# EAGLE design Hexapod REV1 (EAGLE 7.7.0)
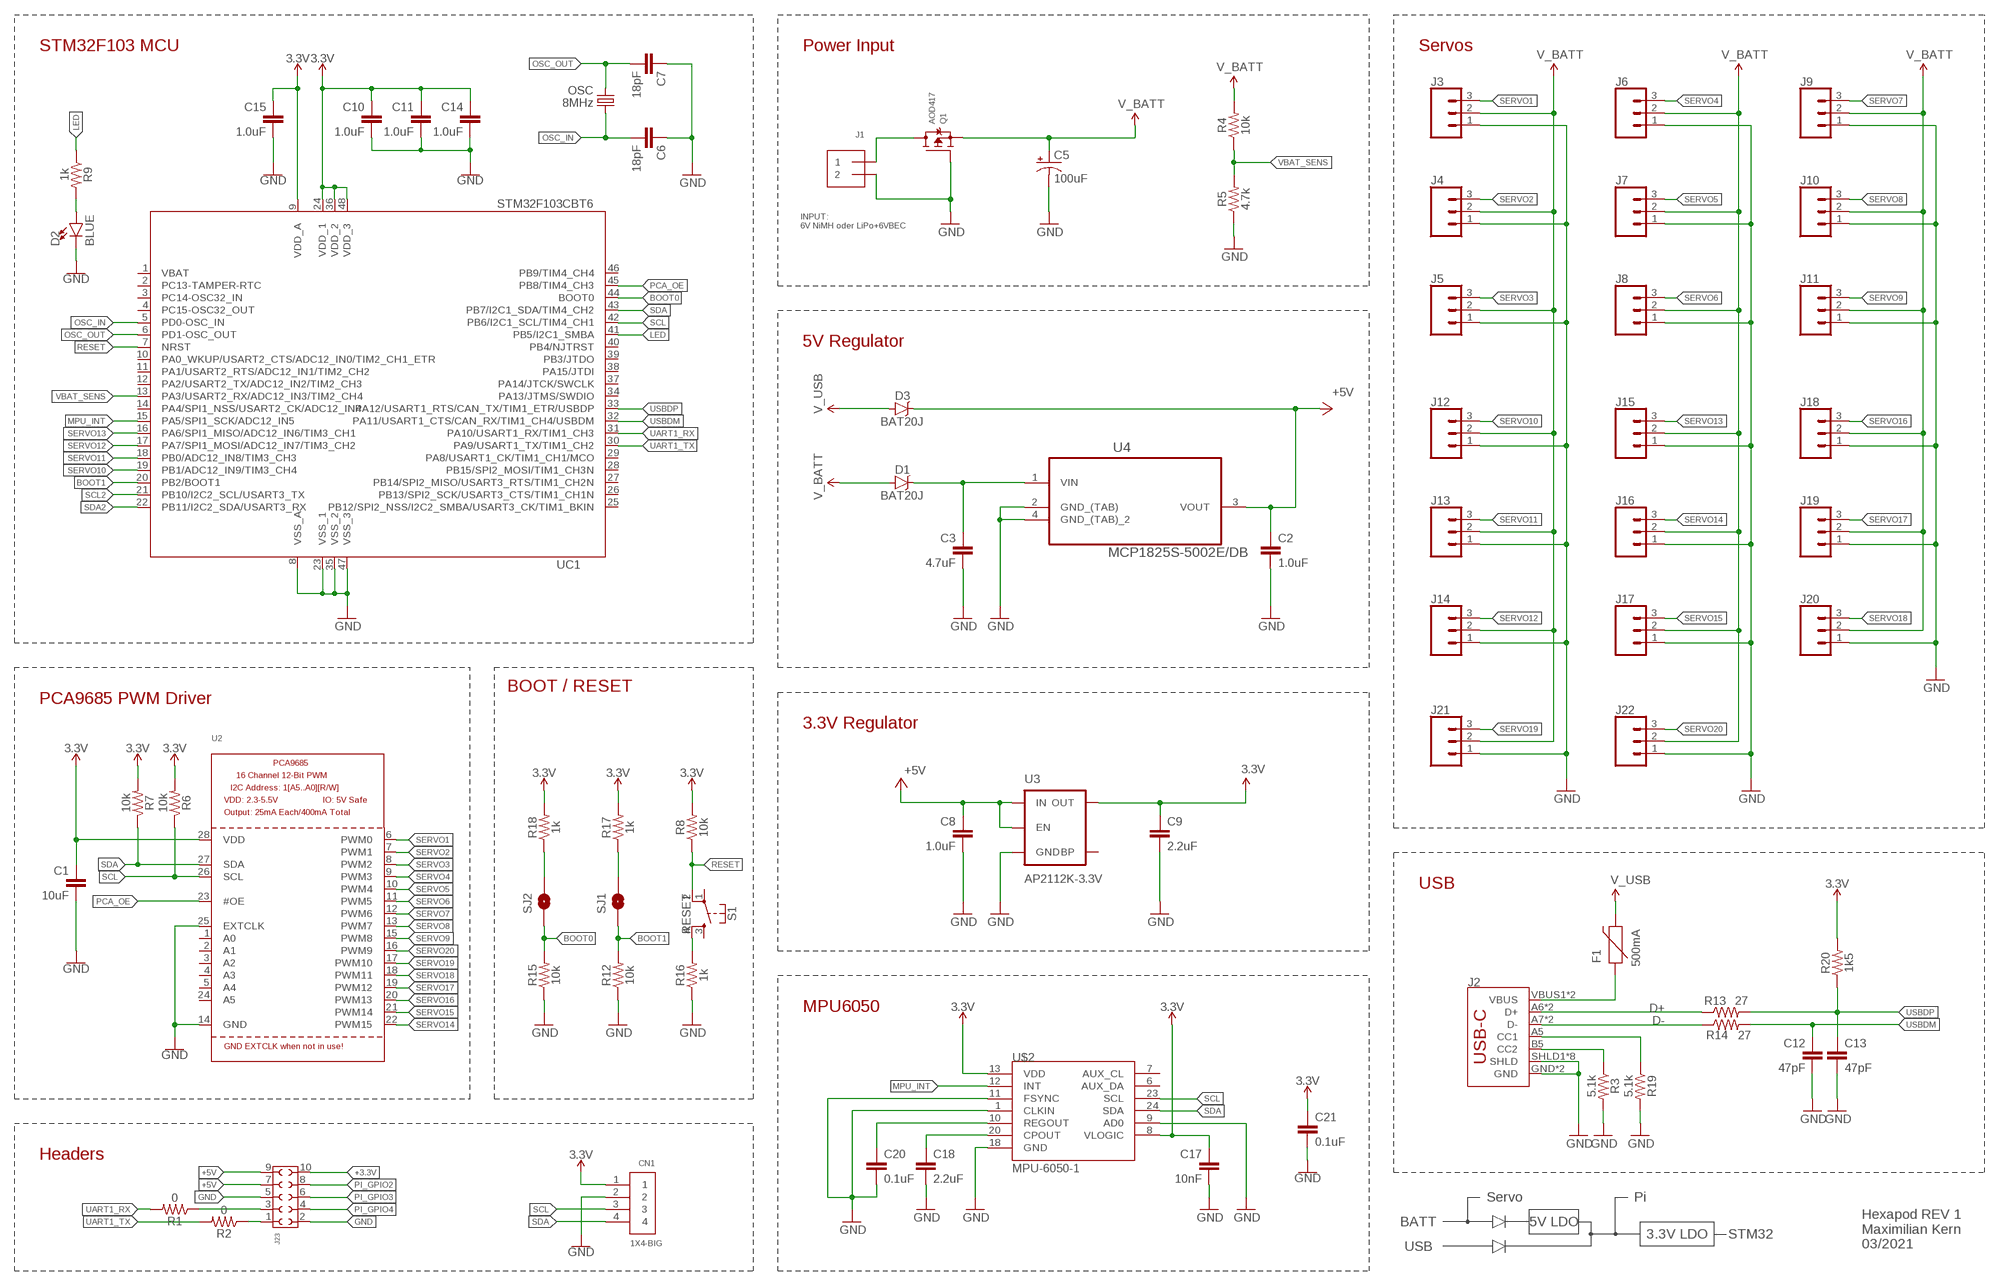
[diagram p0: schematic, sheet 1]

## Parts
C1  10uF  1.0UF-0805-25V-(+80/-20%)  [0805]
C2  1.0uF  1.0UF-0805-25V-(+80/-20%)  [0805]
C3  4.7uF  1.0UF-0805-25V-(+80/-20%)  [0805]
C5  100uF  100UF-POLAR-25V-20%(ELEC)  [PANASONIC_D]
C6  18pF  47PF-0603-50V-5%  [0603]
C7  18pF  47PF-0603-50V-5%  [0603]
C8  1.0uF  1.0UF-0805-25V-(+80/-20%)  [0805]
C9  2.2uF  1.0UF-0805-25V-(+80/-20%)  [0805]
C10  1.0uF  1.0UF-0805-25V-(+80/-20%)  [0805]
C11  1.0uF  1.0UF-0805-25V-(+80/-20%)  [0805]
C12  47pF  47PF-0603-50V-5%  [0603]
C13  47pF  47PF-0603-50V-5%  [0603]
C14  1.0uF  1.0UF-0805-25V-(+80/-20%)  [0805]
C15  1.0uF  1.0UF-0805-25V-(+80/-20%)  [0805]
C17  10nF  47PF-0603-50V-5%  [0603]
C18  2.2uF  1.0UF-0805-25V-(+80/-20%)  [0805]
C20  0.1uF  0.1UF-0603-25V-(+80/-20%)  [0603]
C21  0.1uF  0.1UF-0603-25V-(+80/-20%)  [0603]
CN1  1X4-BIG  [1X04-BIG]
D1  BAT20J  DIODE-SCHOTTKY-BAT20J  [SOD-323]
D2  BLUE  LED-BLUE0603  [LED-0603@2]
D3  BAT20J  DIODE-SCHOTTKY-BAT20J  [SOD-323]
F1  500mA  PTCSMD  [PTC-1206]
J1  TERMBLOCK_1X2  [TERMBLOCK_1X2-3.5MM]
J2  USB_C16PIN  [USB-C-16P]
J3  CONN_03  [1X03]
J4  CONN_03  [1X03]
J5  CONN_03  [1X03]
J6  CONN_03  [1X03]
J7  CONN_03  [1X03]
J8  CONN_03  [1X03]
J9  CONN_03  [1X03]
J10  CONN_03  [1X03]
J11  CONN_03  [1X03]
J12  CONN_03  [1X03]
J13  CONN_03  [1X03]
J14  CONN_03  [1X03]
J15  CONN_03  [1X03]
J16  CONN_03  [1X03]
J17  CONN_03  [1X03]
J18  CONN_03  [1X03]
J19  CONN_03  [1X03]
J20  CONN_03  [1X03]
J21  CONN_03  [1X03]
J22  CONN_03  [1X03]
J23  6103XX21821_61031021821  [61031021821]
OSC  8MHz  CRYSTAL5X3  [CRYSTAL-SMD-5X3]
Q1  AOD417  MOSFET-PTO252  [TO252]
R1  0  10KOHM-0603-1/10W-1%  [0603]
R2  0  10KOHM-0603-1/10W-1%  [0603]
R3  5.1k  10KOHM-0603-1/10W-1%  [0603]
R4  10k  10KOHM-0603-1/10W-1%  [0603]
R5  4.7k  10KOHM-0603-1/10W-1%  [0603]
R6  10k  10KOHM-0603-1/10W-1%  [0603]
R7  10k  10KOHM-0603-1/10W-1%  [0603]
R8  10k  10KOHM-0603-1/10W-1%  [0603]
R9  1k  1KOHM-0603-1/10W-1%  [0603]
R12  10k  10KOHM-0603-1/10W-1%  [0603]
R13  27  27OHM1/10W1%(0603)0603-RES  [0603]
R14  27  27OHM1/10W1%(0603)0603-RES  [0603]
R15  10k  10KOHM-0603-1/10W-1%  [0603]
R16  1k  10KOHM-0603-1/10W-1%  [0603]
R17  1k  10KOHM-0603-1/10W-1%  [0603]
R18  1k  10KOHM-0603-1/10W-1%  [0603]
R19  5.1k  10KOHM-0603-1/10W-1%  [0603]
R20  1k5  10KOHM-0603-1/10W-1%  [0603]
S1  RESET  MOMENTARY-SWITCH-SPST-2-SMD-4.6X2.8MM  [TACTILE_SWITCH_SMD_4.6X2.8MM]
SJ1  JUMPER-PAD-2-NOYES_SILK  [PAD-JUMPER-2-NO_YES_SILK]
SJ2  JUMPER-PAD-2-NOYES_SILK  [PAD-JUMPER-2-NO_YES_SILK]
U2  PCA9685  [TSSOP28]
U3  AP2112K-3.3V  V_REG_LDOSMD  [SOT23-5]
U4  MCP1825S-5002E/DB  [SOT230P700X180-4N]
U$2  MPU-6050-1  [QFN-24-4MM2]
UC1  STM32F103CBT6  STM32F103CB  [LQFP48]

## Nets
3.3V: C1.1 C9.1 C10.1 C11.1 C14.1 C15.1 C17.1 C21.1 CN1.1 R6.2 R7.2 R8.2 R17.2 R18.2 R20.2 U2.28(VDD) U3.5(OUT) U$2.8(VLOGIC) U$2.13(VDD) UC1.9(VDD_A) UC1.24(VDD_1) UC1.36(VDD_2) UC1.48(VDD_3)
+3.3V: J23.10
+5V: C2.1 C8.1 D3.C J23.7 J23.9 U3.1(IN) U3.3(EN) U4.3(VOUT)
BOOT0: R15.2 SJ2.1 UC1.44(BOOT0)
BOOT1: R12.2 SJ1.1 UC1.20(PB2/BOOT1)
D+: J2.A6(D+) J2.B6(D+) R13.1
D-: J2.A7(D-) J2.B7(D-) R14.1
GND: C1.2 C2.2 C3.2 C5.- C6.1 C7.1 C8.2 C9.2 C10.2 C11.2 C12.2 C13.2 C14.2 C15.2 C17.2 C18.2 C20.2 C21.2 CN1.2 D2.C J1.2 J2.GND J2.GND2(GND) J2.SHLD1(SHLD) J2.SHLD2(SHLD) J2.SHLD3(SHLD) J2.SHLD4(SHLD) J2.SHLD5(SHLD) J2.SHLD6(SHLD) J2.SHLD7(SHLD) J2.SHLD8(SHLD) J3.1 J4.1 J5.1 J6.1 J7.1 J8.1 J9.1 J10.1 J11.1 J12.1 J13.1 J14.1 J15.1 J16.1 J17.1 J18.1 J19.1 J20.1 J21.1 J22.1 J23.2 J23.5 Q1.1(G) R3.2 R5.1 R12.1 R15.1 R16.1 R19.2 U2.14(GND) U2.25(EXTCLK) U3.2(GND) U4.2(GND_(TAB)) U4.4(GND_(TAB)_2) U$2.1(CLKIN) U$2.9(AD0) U$2.11(FSYNC) U$2.18(GND) UC1.8(VSS_A) UC1.23(VSS_1) UC1.35(VSS_2) UC1.47(VSS_3)
LED: R9.1 UC1.41(PB5/I2C1_SMBA)
MPU_INT: U$2.12(INT) UC1.15(PA5/SPI1_SCK/ADC12_IN5)
N$1: R16.2 S1.4
N$2: R18.1 SJ2.2
N$3: R17.1 SJ1.2
N$4: C3.1 D1.C U4.1(VIN)
N$5: D2.A R9.2
N$6: J1.1 Q1.3(D)
N$9: J2.A5(CC1) R19.1
N$11: J2.B5(CC2) R3.1
N$17: C18.1 U$2.20(CPOUT)
N$18: C20.1 U$2.10(REGOUT)
OSC_IN: C6.2 OSC.1 UC1.5(PD0-OSC_IN)
OSC_OUT: C7.2 OSC.3 UC1.6(PD1-OSC_OUT)
PCA_OE: U2.23(#OE) UC1.45(PB8/TIM4_CH3)
PI_GPIO2: J23.8
PI_GPIO3: J23.6
PI_GPIO4: J23.4
PI_RXD: J23.1 R2.1
PI_TXD: J23.3 R1.1
RESET: R8.1 S1.2 UC1.7(NRST)
SCL: CN1.3 R6.1 U2.26(SCL) U$2.23(SCL) UC1.42(PB6/I2C1_SCL/TIM4_CH1)
SCL2: UC1.21(PB10/I2C2_SCL/USART3_TX)
SDA: CN1.4 R7.1 U2.27(SDA) U$2.24(SDA) UC1.43(PB7/I2C1_SDA/TIM4_CH2)
SDA2: UC1.22(PB11/I2C2_SDA/USART3_RX)
SERVO1: J3.3 U2.6(PWM0)
SERVO2: J4.3 U2.7(PWM1)
SERVO3: J5.3 U2.8(PWM2)
SERVO4: J6.3 U2.9(PWM3)
SERVO5: J7.3 U2.10(PWM4)
SERVO6: J8.3 U2.11(PWM5)
SERVO7: J9.3 U2.12(PWM6)
SERVO8: J10.3 U2.13(PWM7)
SERVO9: J11.3 U2.15(PWM8)
SERVO10: J12.3 UC1.19(PB1/ADC12_IN9/TIM3_CH4)
SERVO11: J13.3 UC1.18(PB0/ADC12_IN8/TIM3_CH3)
SERVO12: J14.3 UC1.17(PA7/SPI1_MOSI/ADC12_IN7/TIM3_CH2)
SERVO13: J15.3 UC1.16(PA6/SPI1_MISO/ADC12_IN6/TIM3_CH1)
SERVO14: J16.3 U2.22(PWM15)
SERVO15: J17.3 U2.21(PWM14)
SERVO16: J18.3 U2.20(PWM13)
SERVO17: J19.3 U2.19(PWM12)
SERVO18: J20.3 U2.18(PWM11)
SERVO19: J21.3 U2.17(PWM10)
SERVO20: J22.3 U2.16(PWM9)
UART1_RX: R1.2 UC1.31(PA10/USART1_RX/TIM1_CH3)
UART1_TX: R2.2 UC1.30(PA9/USART1_TX/TIM1_CH2)
USBDM: C12.1 R14.2 UC1.32(PA11/USART1_CTS/CAN_RX/TIM1_CH4/USBDM)
USBDP: C13.1 R13.2 R20.1 UC1.33(PA12/USART1_RTS/CAN_TX/TIM1_ETR/USBDP)
V_BATT: C5.+ D1.A J3.2 J4.2 J5.2 J6.2 J7.2 J8.2 J9.2 J10.2 J11.2 J12.2 J13.2 J14.2 J15.2 J16.2 J17.2 J18.2 J19.2 J20.2 J21.2 J22.2 Q1.2(S) R4.2
V_USB: D3.A F1.2
VBAT_SENS: R4.1 R5.2 UC1.13(PA3/USART2_RX/ADC12_IN3/TIM2_CH4)
VUSB-RAW: F1.1 J2.VBUS1(VBUS) J2.VBUS2(VBUS)
Unconnected: S1.1 S1.3 U2.1(A0) U2.2(A1) U2.3(A2) U2.4(A3) U2.5(A4) U2.24(A5) U3.4(BP) U$2.6(AUX_DA) U$2.7(AUX_CL) UC1.2(PC13-TAMPER-RTC) UC1.3(PC14-OSC32_IN) UC1.4(PC15-OSC32_OUT) UC1.10(PA0_WKUP/USART2_CTS/ADC12_IN0/TIM2_CH1_ETR) UC1.11(PA1/USART2_RTS/ADC12_IN1/TIM2_CH2) UC1.12(PA2/USART2_TX/ADC12_IN2/TIM2_CH3) UC1.14(PA4/SPI1_NSS/USART2_CK/ADC12_IN4) UC1.25(PB12/SPI2_NSS/I2C2_SMBA/USART3_CK/TIM1_BKIN) UC1.26(PB13/SPI2_SCK/USART3_CTS/TIM1_CH1N) UC1.27(PB14/SPI2_MISO/USART3_RTS/TIM1_CH2N) UC1.28(PB15/SPI2_MOSI/TIM1_CH3N) UC1.29(PA8/USART1_CK/TIM1_CH1/MCO) UC1.34(PA13/JTMS/SWDIO) UC1.37(PA14/JTCK/SWCLK) UC1.38(PA15/JTDI) UC1.39(PB3/JTDO) UC1.40(PB4/NJTRST) UC1.46(PB9/TIM4_CH4)

## Notes on the sheet
- STM32F103 MCU | Power Input | Servos
- INPUT:
  6V NiMH oder LiPo+6VBEC
- 5V Regulator
- BOOT / RESET
- PCA9685 PWM Driver
- 3.3V Regulator
- USB
- MPU6050
- Headers
- Servo | Pi
- Hexapod REV 1
  Maximilian Kern
  03/2021
- BATT | 5V LDO
- 3.3V LDO | STM32
- USB

## Power pins joined to a net without a drawn wire
VBAT: UC1.1(VBAT)

## Library data of the parts
C1 C3 C9 C18 = SparkFun-Capacitors:1.0UF: 1µF ceramic capacitors A capacitor is a passive two-terminal electrical component used to store electrical energy temporarily in an electric field.; PROD_ID: CAP-11625; VALUE: 1.0uF
C2 C8 C10 C11 C14 C15 = SparkFun-Capacitors:1.0UF: 1µF ceramic capacitors A capacitor is a passive two-terminal electrical component used to store electrical energy temporarily in an electric field.; PROD_ID: CAP-11625
C5 = SparkFun-Capacitors:100UF-POLAR: 100µF polarized capacitors A capacitor is a passive two-terminal electrical component used to store electrical energy temporarily in an electric field.; PROD_ID: CAP-12547
C6 C7 C17 = SparkFun-Capacitors:47PF: 47pF ceramic capacitors A capacitor is a passive two-terminal electrical component used to store electrical energy temporarily in an electric field.; PROD_ID: CAP-08913; VALUE: 47pF
C12 C13 = SparkFun-Capacitors:47PF: 47pF ceramic capacitors A capacitor is a passive two-terminal electrical component used to store electrical energy temporarily in an electric field.; PROD_ID: CAP-08913
C20 C21 = SparkFun-Capacitors:0.1UF: 0.1µF ceramic capacitors A capacitor is a passive two-terminal electrical component used to store electrical energy temporarily in an electric field.; PROD_ID: CAP-00810
CN1 = adafruit:1X4: 4-pin connector
D1 D3 = SparkFun-DiscreteSemi:DIODE-SCHOTTKY: Schottky diodes in SFE's production catalog BAT20J 1A 23V 0.62Vf RB751 120mA 40V 0.37Vf PMEG4005EJ 0.5A 40V 0.42Vf MBRA140 1A 40V 0.5Vf B340A 3A 40V SMA; PROD_ID: DIO-11623
D2 = SparkFun-LED:LED-BLUE: Blue SMD LED Used in manufacturing of various products at SparkFun Packages: 0603 - SMD 0603 package [Product Link] <http://www.digikey.com/product-detail/en/SMLE12BC7TT86/511-1589-2-ND/1641808> 1206 - SMD1206 package [Product Link] <http://www.digikey.com/product-detail/en/lite-on-inc/LTST-C150TBKT/160-1643-1-ND/573584> SparkFun Products: ESP8266 Thing-Dev Board <https://www.sparkfun.com/products/13711> RedBoard <https://www.sparkfun.com/products/12757>; PROD_ID: DIO-08575
F1 = SparkFun-PowerIC:PTC: Resettable Fuse PTC Resettable Fuse. Spark Fun Electronics SKU : COM-08357; PROD_ID: RES-11150
J1 = microbuilder:TERMBLOCK_1X2: 3.5mm Terminal block http://www.ladyada.net/library/pcb/eaglelibrary.html
J2 = SparkFun-Connectors:USB_C: USB Type C 16Pin Connector Super Speed pins not available on the 16-pin purely SMD connector so this part is best for USB 2.0 implementations. D1 and D2 are tied together enabling D+/- no matter which way the cable is plugged into the connector. The two channel configuration pins (CC1/2) are exposed. These are normally connected to ground via 5.1k resistors but can be reconfigured for high current/high power applications.; PROD_ID: CONN-14122
J3-J22 = SparkFun-Connectors:CONN_03: Multi connection point. Often used as Generic Header-pin footprint for 0.1 inch spaced/style header connections On any of the 0.1 inch spaced packages, you can populate with these: Break Away Headers - Straight <https://www.sparkfun.com/products/116> (PRT-00116) Break Away Male Headers - Right Angle <https://www.sparkfun.com/products/553> (PRT-00553) Female Headers <https://www.sparkfun.com/products/115> (PRT-00115) Break Away Headers - Machine Pin <https://www.sparkfun.com/products/117> (PRT-00117) Break Away Female Headers - Swiss Machine Pin <https://www.sparkfun.com/products/743> (PRT-00743) Stackable Header - 3 Pin (Female, 0.1") <https://www.sparkfun.com/products/13875> (PRT-13875) For SCREWTERMINALS and SPRING TERMINALS visit here: Screw Terimnals on SparkFun.com <https://www.sparkfun.com/search/results?term=Screw+Terminals> (5mm/3.5mm/2.54mm spacing) This device is also useful as a general connection point to wire up your design to another part of your project. Our various solder wires solder well into these plated through hole pads. Hook-Up Wire - Assortment (Stranded, 22 AWG) <https://www.sparkfun.com/products/11375> (PRT-11375) Hook-Up Wire - Assortment (Solid Core, 22 AWG) <https://www.sparkfun.com/products/11367> (PRT-11367) View the entire wire category on our website here <https://www.sparkfun.com/categories/141> Special notes: Molex polarized connector foot print use with SKU : PRT-08232 with associated crimp pins and housings.; PROD_ID: XXX-00000; VALUE: 455-1750-1-ND
J23 = Eagle_WR-PHD (rev19a):6103XX21821_61031021821: WR-PHD 2.54 mm SMT Dual Socket Header (Reel) ARTICLE PROPERTIES Pins ： 4;​ 6;​ 8;​ 10;​ 12;​ 14;​ 16;​ 18;​ 20;​ 22;​ 24;​ 26 KIND PROPERTIES Pitch 2.54 mm Quality Class 3 as per CECC 75 301-802 Rows Dual Gender Socket Header Type Straight Type 2 MATERIAL PROPERTIES Insulator Material PA46 Insulator Flammability Rating UL94 V-0 Contact Material Copper Alloy Contact Plating Gold Contact Type Stamped GENERAL INFORMATION Operating Temperature -40 up to +105 °C ELECTRICAL PROPERTIES Rated Current 3 A IR1 = 3A Withstanding Voltage 600 V (AC) Contact Resistance 20 mΩ RISO 1000 MΩ CERTIFICATION UL Approval E323964 PACKAGING PROPERTIES Packaging Tape and Reel with Cap <https://katalog.we-online.com/media/images/v2/o33206v209%20Family_WR-PHD_610xxx21821.jpg> Details see: https://katalog.we-online.com/en/em/PHD_2_54_SMT_DUAL_SOCKET_HEADER_REEL_6103XX21821 Updated by Ella Wu 2019-06-12 2019 (C) Würth Elektronik; DATASHEET-URL: https://katalog.we-online.com/em/datasheet/61031021821.pdf; GENDER: Socket Header; IR: 3A; PACKAGING: Tape and Reel with Cap; PART-NUMBER: 61031021821; PINS: 10; ROWS: Dual; TYPE: Straight Type 2; WE-NUMBER: 61031021821
OSC = SparkFun2:CRYSTAL: Crystals Various standard crystals. Proven footprints. Spark Fun Electronics SKU : COM-00534
Q1 = microbuilder:MOSFET-P: P-Channel Mosfet LEGEND VDS: Voltage Drain-Source ID: Drain Current RDS(ON): Drain-Source On-State Resistance VGS(TH): Gate-Source Threshold Voltage CISS: Drain-Source Input Capacitance SOT-23 Name VDS ID RDS(ON) VGS(TH) CISS Order Number IRLML5103 30V 760mA 600 mOhm -- 75pF @ 25V Digikey: IRLML5103PBFCT-ND IRLML6401 12V 4.3A 50 mOhm 950mV @ 250µA 830pF @ 10V Digikey: IRLML6401PBFTR-ND NTR0202PL 20V 400mA 800 mOhm 2.3V @ 250uA 70pF @ 5V Digikey: NTR0202PLT1GOSTR-ND NTR4101PT1G 20V 1.8A 85 mOhm 1.2V @ 250uA 675pF @ 10V Digikey: NTR4101PT1GOSCT-ND DMP2004K 20V 600mA 900 mOhm 1V @ 250uA 175pF @ 16V Digikey: DMP2004KDICT-ND PMV65XP 20V 3.9A 76 mOhm 950mV @ 1mA 725pF @ 20V Digikey: 568-2358-2-ND TO-252 Name VDS ID RDS(ON) VGS(TH) CISS Order Number AOD417 30V 25A 34 mOhm 3V @ 250µA 920pF @ 15V Digikey: 785-1106-2-ND
R1-R3 R5 R16-R20 = SparkFun-Resistors:10KOHM: 10kΩ resistor A resistor is a passive two-terminal electrical component that implements electrical resistance as a circuit element. Resistors act to reduce current flow, and, at the same time, act to lower voltage levels within circuits. - Wikipedia; PROD_ID: RES-00824; VALUE: 10k
R4 R6-R8 R12 R15 = SparkFun-Resistors:10KOHM: 10kΩ resistor A resistor is a passive two-terminal electrical component that implements electrical resistance as a circuit element. Resistors act to reduce current flow, and, at the same time, act to lower voltage levels within circuits. - Wikipedia; PROD_ID: RES-00824
R9 = SparkFun-Resistors:1KOHM: 1kΩ resistor A resistor is a passive two-terminal electrical component that implements electrical resistance as a circuit element. Resistors act to reduce current flow, and, at the same time, act to lower voltage levels within circuits. - Wikipedia; PROD_ID: RES-07856
R13 R14 = SparkFun-Resistors:27OHM1/10W1%(0603): RES-09334; PROD_ID: RES-09334
S1 = SparkFun-Switches:MOMENTARY-SWITCH-SPST-2: Momentary Switch (Pushbutton) - SPST - Two Circuits Normally-open (NO) SPST momentary switches (buttons, pushbuttons). Schematic symbol includes two switch circuits. Variants SMD-4.6MMX2.8MM - 4.60mm x 2.80mm Tactile Momentary Button Switch - Used on SparkFun SAMD21 Mini Breakout <https://www.sparkfun.com/products/13664> SMD-5.2MM - Mini Pushbutton Switch - SMD <https://www.sparkfun.com/products/8720> - Used on Arduino Pro Mini <https://www.sparkfun.com/products/11114>; PROD_ID: SWCH-13065
SJ1 SJ2 = SparkFun-Passives:JUMPER-PAD-2-NO
U2 = adafruit:PCA9685: PCA9685 - 16 Channel 12-Bit I2C PWM Controller 5.0V tolerant 16 channel, 12-bit I2C PWM controller with 25mA per output (max. 400mA total) Digikey: 568-5931-1-ND
U3 = SparkFun-PowerIC:V_REG_LDO: Voltage Regulator LDO Standard 150mA LDO voltage regulator in SOT-23 layout. Micrel part MIC5205. BP (by-pass) pin is used to lower output noise with 470pF cap.; PROD_ID: VREG-12457
U4 = Microchip_By_element14_Batch_1:MCP1825S-5002E/DB: IC, LDO, 5.0V, 500MA; MPN: MCP1825S-5002E/DB; OC_FARNELL: 1578407; OC_NEWARK: 26M9964; PACKAGE: SOT-223-3; SUPPLIER: Microchip
U$2 = MPU-6050 hand solder:MPU-6050
UC1 = stm32:STM32F103CB

## Board
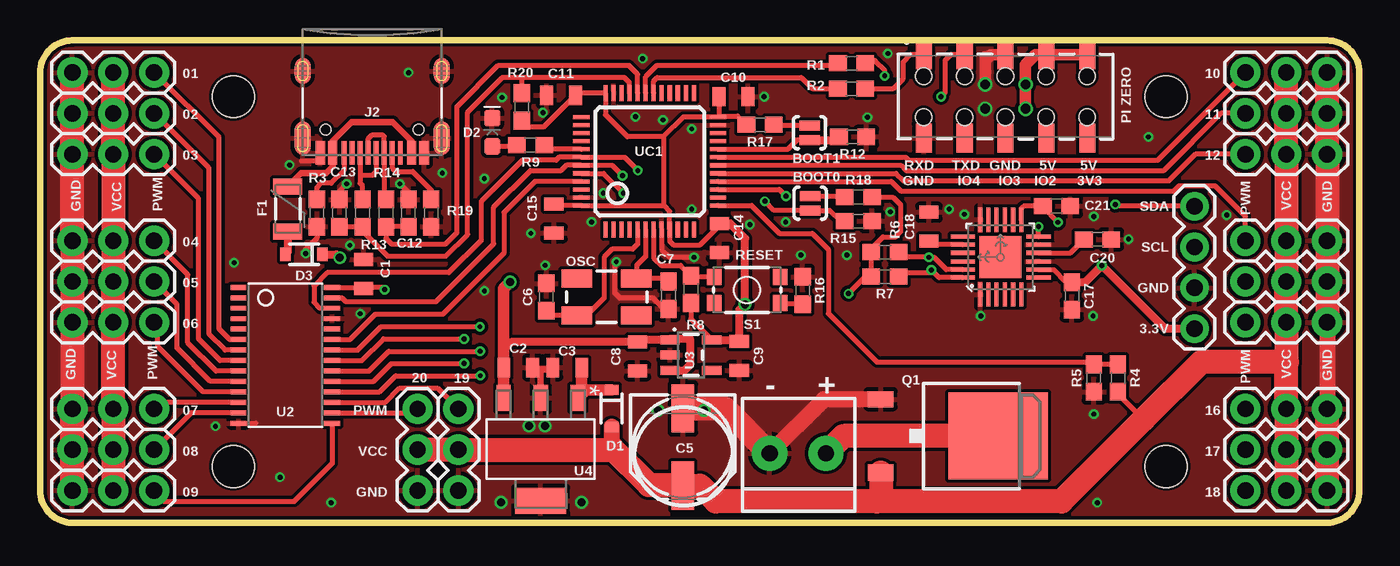
[diagram p1: board, top side]
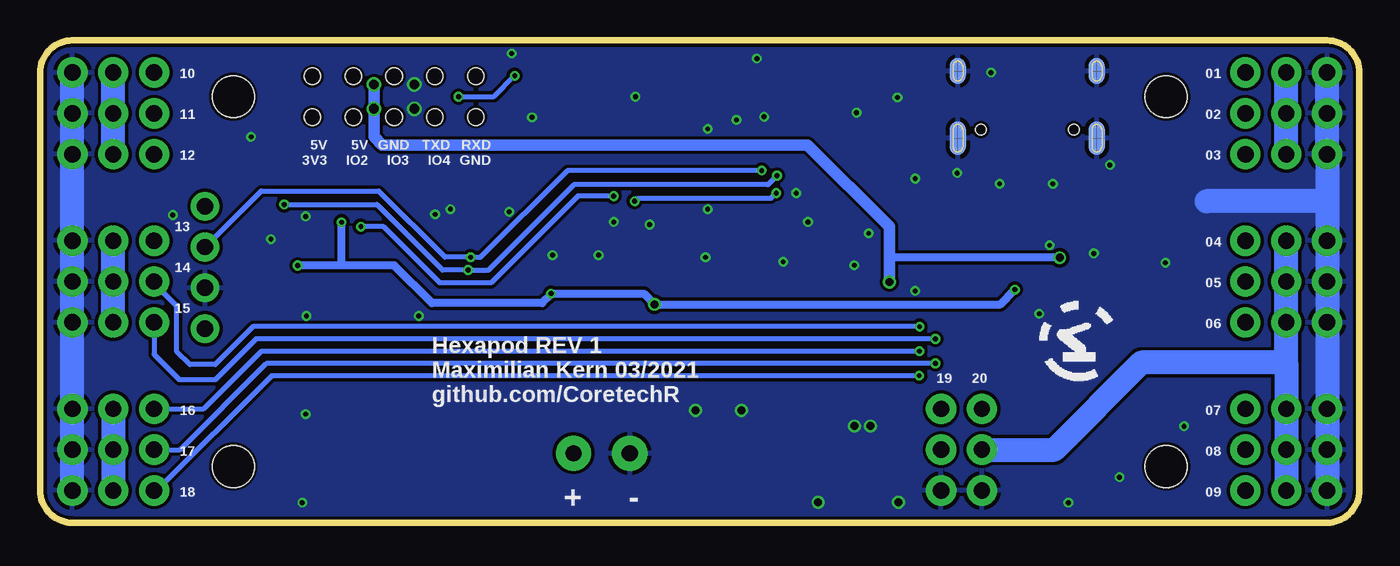
[diagram p2: board, bottom side, seen from below]

Size 82 x 30 mm. Coordinates in mm from the lower left corner, seen from the top.
Outline: 2,0 arc-90 0,2 0,28 arc-90 2,30 80,30 arc-90 82,28 82,2 arc-90 80,0 2,0
Copper layers (1*16): Top 0.035mm / dielectric 1.5mm / Bottom 0.035mm
Design rules "aisler_2_layer *": minimum track width 0.2mm, minimum drill 0.2mm, track to track 0.2mm, track to pad 0.2mm, pad to pad 0.2mm, via to via 0.2mm, smd to smd 0.1mm, copper to edge 0.2mm, drill to drill 0.21mm, minimum pad ring 0.25mm, minimum via ring 0.15mm, stop-mask expansion 2.5mil, vias tented up to drill 43mil, thermal gap 10mil
Holes 2.6 mm at 70,26.5 12,26.5 12,3.5 70,3.5
Holes 1 mm at 54.92,27.77 57.46,27.77 60,27.77 62.54,27.77 65.08,27.77 65.08,25.23 62.54,25.23 60,25.23 57.46,25.23 54.92,25.23

### Footprints (pad centres in the part's own frame; a part is rotated, then mirrored left to right if it is on the bottom)
0805 = smd 0.8 x 1.2: 1 -0.9,0; 2 0.9,0
PANASONIC_D = smd 3 x 1.4: + 2.4,0; - -2.4,0
0603 = smd 1.1 x 1: 1 -0.85,0; 2 0.85,0
1X04-BIG = drill 1.016 pad 1.778: 1 0,0; 2 2.54,0; 3 5.08,0; 4 7.62,0
SOD-323 = smd 0.63 x 0.83: A 1.15,0; C -1.15,0
LED-0603@2 = smd 1 x 1: A -0.877,0; C 0.877,0
PTC-1206 = smd 1 x 1.8: 1 -1.4,0; 2 1.4,0
TERMBLOCK_1X2-3.5MM = drill 1 pad 2.184: 1 1.8,0; 2 -1.7,0
USB-C-16P = smd 0.3 x 1.45: A5 -1.25,0; A6 -0.25,0; A7 0.25,0; A8 1.25,0; B5 1.75,0; B6 0.75,0; B7 -0.75,0; B8 -1.75,0 | smd 0.6 x 1.45: GND -3.225,0; GND2 3.225,0 | smd 1 x 2.1: SHLD1 -4.32,-0.915; SHLD2 4.32,-0.915 | smd 1 x 2.1 bottom: SHLD3 -4.32,-0.915; SHLD4 4.32,-0.915 | smd 1 x 1.6: SHLD5 -4.32,-5.095; SHLD8 4.32,-5.095 | smd 1 x 1.6 bottom: SHLD6 -4.32,-5.095; SHLD7 4.32,-5.095 | smd 0.55 x 1.45: VBUS1 -2.45,0; VBUS2 2.45,0 | hole 0.65: -2.89,-1.445; 2.89,-1.445
1X03 = drill 1.016 pad 1.88: 1 0,0; 2 2.54,0; 3 5.08,0
61031021821 = smd 1 x 1.8: 1 -5.08,2.6; 2 -5.08,-2.6; 3 -2.54,2.6; 4 -2.54,-2.6; 5 0,2.6; 6 0,-2.6; 7 2.54,2.6; 8 2.54,-2.6; 9 5.08,2.6; 10 5.08,-2.6
CRYSTAL-SMD-5X3 = smd 1.9 x 1.1: 1 -1.85,-1.15; 2 1.85,-1.15; 3 1.85,1.15; 4 -1.85,1.15
TO252 = smd 1 x 1.6: 1 -2.28,-4.8; 2 2.28,-4.8 | smd 5.4 x 6.2: 3 0,2.5
TACTILE_SWITCH_SMD_4.6X2.8MM = smd 0.9 x 1: 1 -2.05,-0.8; 2 2.05,-0.8; 3 2.05,0.8; 4 -2.05,0.8
PAD-JUMPER-2-NO_YES_SILK = smd 0.635 x 1.27: 1 -0.45,0; 2 0.45,0
TSSOP28 = smd 0.305 x 0.991: 1 -4.225,-2.918; 2 -3.575,-2.918; 3 -2.925,-2.918; 4 -2.275,-2.918; 5 -1.625,-2.918; 6 -0.975,-2.918; 7 -0.325,-2.918; 8 0.325,-2.918; 9 0.975,-2.918; 10 1.625,-2.918; 11 2.275,-2.918; 12 2.925,-2.918; 13 3.575,-2.918; 14 4.225,-2.918; 15 4.225,2.918; 16 3.575,2.918; 17 2.925,2.918; 18 2.275,2.918; 19 1.625,2.918; 20 0.975,2.918; 21 0.325,2.918; 22 -0.325,2.918; 23 -0.975,2.918; 24 -1.625,2.918; 25 -2.275,2.918; 26 -2.925,2.918; 27 -3.575,2.918; 28 -4.225,2.918
SOT23-5 = smd 0.55 x 1.2: 1 -0.95,-1.3; 2 0,-1.3; 3 0.95,-1.3; 4 0.95,1.3; 5 -0.95,1.3
SOT230P700X180-4N = smd 1.626 x 0.889: 1 -3.2,2.311; 2 -3.2,0; 3 -3.2,-2.311 | smd 1.626 x 3.175: 4 3.2,0
QFN-24-4MM2 = smd 1.516 x 0.254: 1 -2.316,1.257; 2 -2.316,0.75; 3 -2.316,0.247; 4 -2.316,-0.287; 5 -2.316,-0.792; 6 -2.316,-1.297; 13 2.336,-1.297; 14 2.336,-0.792; 15 2.336,-0.287; 16 2.336,0.247; 17 2.336,0.75; 18 2.336,1.257 | smd 0.254 x 1.516: 7 -1.267,-2.372; 8 -0.762,-2.372; 9 -0.258,-2.372; 10 0.278,-2.372; 11 0.78,-2.372; 12 1.287,-2.372; 19 1.287,2.332; 20 0.78,2.332; 21 0.278,2.332; 22 -0.258,2.332; 23 -0.762,2.332; 24 -1.267,2.332 | smd 2.616 x 2.616: P$1 0.02,-0.01
LQFP48 = smd 0.254 x 1: 1 -2.75,-4.25; 2 -2.25,-4.25; 3 -1.75,-4.25; 4 -1.25,-4.25; 5 -0.75,-4.25; 6 -0.25,-4.25; 7 0.25,-4.25; 8 0.75,-4.25; 9 1.25,-4.25; 10 1.75,-4.25; 11 2.25,-4.25; 12 2.75,-4.25; 25 2.75,4.25; 26 2.25,4.25; 27 1.75,4.25; 28 1.25,4.25; 29 0.75,4.25; 30 0.25,4.25; 31 -0.25,4.25; 32 -0.75,4.25; 33 -1.25,4.25; 34 -1.75,4.25; 35 -2.25,4.25; 36 -2.75,4.25 | smd 1 x 0.254: 13 4.25,-2.75; 14 4.25,-2.25; 15 4.25,-1.75; 16 4.25,-1.25; 17 4.25,-0.75; 18 4.25,-0.25; 19 4.25,0.25; 20 4.25,0.75; 21 4.25,1.25; 22 4.25,1.75; 23 4.25,2.25; 24 4.25,2.75; 37 -4.25,2.75; 38 -4.25,2.25; 39 -4.25,1.75; 40 -4.25,1.25; 41 -4.25,0.75; 42 -4.25,0.25; 43 -4.25,-0.25; 44 -4.25,-0.75; 45 -4.25,-1.25; 46 -4.25,-1.75; 47 -4.25,-2.25; 48 -4.25,-2.75

### Placement (x,y rotation side)
C1  20.11,15.47 90 top
C2  29.72,9.65 0 top
C3  32.77,9.65 180 top
C5  39.95,4.71 270 top
C6  31.46,14.04 270 top
C7  39.06,14.15 90 top
C8  37.14,10.34 270 top
C9  43.46,10.37 270 top
C10  43.1,26.5 0 top
C11  32.37,26.59 180 top
C12  22.9,19.26 90 top
C13  18.6,19.26 90 top
C14  42.23,17.71 270 top
C15  31.93,18.92 270 top
C17  64.14,14.11 270 top
C18  55.24,18.41 90 top
C20  65.72,17.62 0 top
C21  63.18,19.68 0 top
CN1  71.75,12.06 90 top
D1  35.53,7.11 270 top
D2  28.1,24.29 90 top
D3  16.39,16.69 180 top
F1  15.39,19.52 270 top
J1  47.05,4.32 0 top
J2  20.64,23 180 top
J3  2,28 0 top
J4  2,25.46 0 top
J5  2,22.92 0 top
J6  2,17.54 0 top
J7  2,15 0 top
J8  2,12.46 0 top
J9  2,7.08 0 top
J10  2,4.54 0 top
J11  2,2 0 top
J12  80,28 180 top
J13  80,25.46 180 top
J14  80,22.92 180 top
J15  80,17.54 180 top
J16  80,15 180 top
J17  80,12.46 180 top
J18  80,7.08 180 top
J19  80,4.54 180 top
J20  80,2 180 top
J21  26,2 90 top
J22  23.46,2 90 top
J23  60.01,26.51 0 top
OSC  35.21,14.04 0 top
Q1  57.05,5.4 270 top
R1  50.44,28.57 180 top
R2  50.44,26.99 180 top
R3  17.2,19.26 270 top
R4  67,9 270 top
R5  65.5,9 90 top
R6  52.51,16.83 180 top
R7  52.51,15.3 180 top
R8  40.45,14.51 270 top
R9  30.48,23.5 180 top
R12  50.5,24 180 top
R13  20.04,19.26 270 top
R14  21.5,19.26 270 top
R15  50.87,18.75 180 top
R16  47.4,14.44 270 top
R17  44.75,24.75 180 top
R18  50.87,20.25 0 top
R19  24.3,19.26 270 top
R20  29.94,25.86 270 top
S1  43.94,14.48 180 top
SJ1  47.82,24.25 90 top
SJ2  47.86,19.87 90 top
U2  15.24,10.41 270 top
U3  40.45,10.43 270 top
U4  31.11,4.57 270 top
U$2  59.69,16.51 90 top
UC1  37.88,22.48 0 top

### Tracks (layer width: path | path; a pad name or v marks a point on that pad's centre or on a via)
3.3V  (via drill 0.3, 0.5)
  Top 0.3: R8.2 40.45,12.68 U3.5 | U$2.8 63,15.75 63.79,14.96 C17.1 | C15.1 32.03,19.73 UC1.48 38.77,19.73 | U$2.13 60.99,19.55 61.12,19.68 C21.1 62.33,19.62 v63.27,18.68 | v21.41,14.5 21.27,14.64 20.18,14.64 C1.1 20.04,14.64 U2.28 | C10.1 42.2,25.29 | 42.2,25.29 UC1.24 39.98,25.23 38.75,24 | R18.2 53,20.25 53.5,19.75 53.5,18.1 53.18,17.78 52.39,17.78 51.66,17.06 R6.2 R7.2 51.3,15.3 v50.25,14.25 | 38.77,19.73 39.13,19.37 UC1.9 39.13,17.51 39.37,17.27 41.02,17.27 42.23,18.47 C14.1 | 38.75,24 38.75,19.75 38.77,19.73 | 38.75,24 36.5,24 35.13,25.37 UC1.36 33.41,26.73 C11.1 31.29,24.61 30.35,24.61 R20.2 | 42.2,25.29 43.36,25.29 R17.2
  Top 0.5: U3.5 43.36,11.38 | C9.1 43.46,13.23 v43.81,13.59 43.81,17.68 42.89,18.61 C14.1 | C17.1 64.95,14.96 v66,16 69.94,12.06 CN1.1
  Top 0.7: 43.36,11.38 C9.1
  Bottom 0.5: 63.27,16 60,16 57.65,13.65 50.8,13.65 50.25,14.2 v50.25,14.25 44.48,14.25 v43.81,13.59 22.32,13.59 v21.41,14.5 | 63.27,16 v66,16 | 63.27,16 v63.27,18.68
+5V  (via drill 0.5, 0.6)
  Top 0.3: C2.1 28.82,9.4 28.8,9.38
  Top 0.5: U3.3 40.05,9.48 40.39,9.81 40.39,11.43 39.2,11.43 U3.1 37.27,11.38 C8.1 29.27,11.24 28.82,10.78 | D3.C 18.41,16.69 v18.62,16.48
  Top 0.7: U4.3 28.8,9.38 | C2.1 28.82,10.78 28.82,14.58 v29.21,14.97 | v61.25,25.75 61.25,28.5 61.86,29.11 J23.7 J23.9
  Bottom 0.3: 60.75,23.5 60.65,23.5
  Bottom 0.406: 29.18,16.48 29.21,16.51
  Bottom 0.5: v18.62,16.48 29.18,16.48
  Bottom 0.7: v29.21,14.97 29.21,16.51 29.21,18.41 34.29,23.5 60.64,23.5 60.65,23.5 | 60.75,23.5 61.25,24 v61.25,25.75 v61.25,27.25
BOOT0  (via drill 0.3)
  Top 0.3: UC1.44 35.02,21.73 v36.25,20.5 | v45.05,20 45.62,19.42 SJ2.1 49.08,19.42 49.75,18.75 R15.2
  Bottom 0.3: v45.05,20 44.87,20.18 36.57,20.18 v36.25,20.5
BOOT1
  Top 0.3: UC1.20 46.48,23.23 47.05,23.8 SJ1.1
  Top 0.5: SJ1.1 49.45,23.8 R12.2
D+
  Top 0.3: R13.1 20.04,20.96 19.89,21.11 J2.B6 | J2.A6 20.89,21.84 20.64,21.59 20,21.59
D-
  Top 0.3: R14.1 21.39,20.23 J2.B7 21.39,24.02 21.27,24.13 20.64,24.13 20.39,23.88 J2.A7
GND  (via drill 0.3, 0.5, 0.6)
  Top 0.3: C13.2 18.6,20.63 v19.05,21.08 | C12.2 22.9,20.53 v22.35,21.08 | UC1.8 38.63,16.99 39.12,16.51 v40.64,16.51 | U2.14 13.41,6.19 | J2.GND2 17.41,22.66 17.25,22.5 16.25,22.5 | R3.2 17.2,17.7 16.5,17 v16.5,16.75 | C7.1 38.77,13.3 38.1,13.97 36.04,13.97 35.72,14.29 35.72,16.03 35.88,16.19
  Top 0.406: U4.2 31.11,9.53 31.75,9.53
  Top 0.7: J23.5 59.11,29.11 59,29 58.75,29 v58.75,27.25
  Top 1: 80,21 J14.1 | J17.1 J18.1 | Q1.1 48.71,7.68 J1.2
  Top 1.5: J17.1 J14.1 J13.1 J12.1 | C5.- 42.56,7.11 J1.2 | J3.1 J4.1 J5.1 J6.1 J9.1 J10.1 J11.1 | J20.1 J19.1 J18.1
  Bottom 1: 2,2.5 2.5,2
  Bottom 1.5: 2,20 J5.1 J4.1 J3.1 | 2,20 J6.1 | J6.1 J9.1 | J6.1 2,2.5 | 2,20 9.5,20 | J12.1 J13.1 J14.1 J18.1 J19.1 J20.1
  other vias: 45,26.5 31.25,25.5 37,25.25 30.5,18 40.5,24.5 35,20.5 35.81,16.23 31.39,16.01 19.25,17.25 25,21.75 15.5,22.25 10.89,6 40.5,19.5 56.5,19.5 65.5,19.05 67.66,17.64 65.5,6.75 33.64,1.26 28.64,1.26 30.39,6.01 31.39,6.01 28.71,26.45 50.15,16.64 44.12,18.55 27.61,21.41 27.61,14.42 52.85,19.34 58.75,25.75 19.89,13 22.89,28 68.89,24 58.47,12.86 65.46,12.86 38.4,6.97 41.26,6.97 47.29,16.64 51.42,25.21 57.45,19.18 46.34,18.71 34.27,18.71 38.72,25.06 52.69,29.18 37.45,28.87 65.71,1.24 14.91,2.83 18.08,1.24 12.05,16.17 73.75,19.13
  pour Top: 0,30 0,0 82,0 82,30
  pour Bottom: 0,30 0,0 83,0 83,30
LED
  Top 0.3: UC1.41 31.6,23.23 R9.1
MPU_INT  (via drill 0.3)
  Top 0.3: UC1.15 45.95,20.73 v46.35,20.32 | U$2.12 62.06,18.43 v62.07,18.41
  Bottom 0.3: v46.35,20.32 48.58,20.32 53.98,14.92 57.15,14.92 60.64,18.41 v62.07,18.41
N$1
  Top 0.3: R16.2 46.08,13.59 S1.4
N$2
  Top 0.3: SJ2.2 49.94,20.32 R18.1
N$3
  Top 0.3: SJ1.2 45.65,24.7 R17.1
N$4
  Top 0.7: D1.C 33.92,8.26 | 33.92,8.26 U4.1 | C3.1 33.67,8.51 33.92,8.26
N$5
  Top 0.3: D2.A 29.55,23.41 R9.2
N$6
  Top 1.5: Q1.3 49.93,5.4 J1.1
N$9
  Top 0.3: R19.1 24.3,20.7 23.16,21.84 22.1,21.84 21.89,22.06 J2.A5
N$11
  Top 0.3: 17.2,20.5 R3.1 17.2,20.85 17.46,21.11 18.1,21.11 18.89,21.9 J2.B5
N$17
  Top 0.3: U$2.20 55.47,17.29 C18.1
N$18
  Top 0.3: U$2.10 64.04,16.79 C20.1
OSC_IN
  Top 0.3: UC1.5 37.13,17.32 36.83,17.02 35.56,17.02 35.05,16.51 35.05,13.97 34.04,12.95 33.42,12.95 OSC.1 31.76,12.89 C6.2
OSC_OUT
  Top 0.3: UC1.6 37.63,16.55 37.08,16 37.08,15.22 | 37.08,15.22 OSC.3 | 37.08,15.22 38.84,15.22 C7.2
PCA_OE
  Top 0.3: UC1.45 30.75,21.23 28.83,19.3 28.83,16.76 25.02,12.95 20.83,12.95 19.26,11.39 U2.23
PI_RXD
  Top 0.3: J23.1 54.11,29.11 53.66,28.66 53.66,27.62 53.03,27 51.75,27 | R2.1 51.75,27 | R2.1 51.74,26.99 51.75,27
PI_TXD  (via drill 0.3)
  Top 0.3: J23.3 56.61,29.11 56.25,28.75 56.25,26.75 v56,26.5 | R1.1 51.46,28.75 51.9,28.75 52.5,28.14 v52.5,27.8
  Bottom 0.3: v56,26.5 53.8,26.5 v52.5,27.8
RESET
  Top 0.3: UC1.7 38.13,16.48 38.61,16 39.81,16 R8.1 40.53,15.28 S1.2
SCL  (via drill 0.3)
  Top 0.3: U2.26 17.39,13.34 17.02,13.72 17.02,14.73 17.84,15.56 25.4,15.56 27.43,17.59 27.43,20 29.97,22.54 32.07,22.54 32.25,22.73 UC1.42 36.33,22.73 v37.15,21.91 | R6.1 53.68,16.51 v55.24,16.51 55.56,16.51 56.33,15.75 U$2.23
  Bottom 0.3: v37.15,21.91 49.21,21.91 54.61,16.51 v55.24,16.51 56.83,16.51 60.96,20.64 68.26,20.64 CN1.3
SDA  (via drill 0.3)
  Top 0.3: v36.2,21.59 35.56,22.23 UC1.43 32.7,22.23 32.38,21.91 30.48,21.91 28.19,19.62 28.19,17.34 24.61,13.75 19,13.75 18.76,13.99 U2.27 | R7.1 53.62,15.56 55.24,15.56 v55.4,15.72 55.88,15.24 U$2.24 | CN1.4 66.94,19.68 v66.83,19.8
  Bottom 0.3: v36.2,21.59 36.76,21.02 48.83,21.02 54.13,15.72 v55.4,15.72 56.99,15.72 61.07,19.8 v66.83,19.8
SERVO1
  Top 0.3: U2.6 11.79,11.39 11.11,12.06 11.11,23.97 J3.3
SERVO2
  Top 0.3: U2.7 11.49,10.74 10.48,11.75 10.48,22.08 10.46,22.08 J4.3
SERVO3
  Top 0.3: U2.8 11.18,10.09 9.84,11.43 9.84,20.19 9.81,20.19 J5.3
SERVO4
  Top 0.3: U2.9 10.93,9.44 9.18,11.18 9.18,15.44 J6.3
SERVO5
  Top 0.3: U2.10 10.58,8.79 8.5,10.87 8.5,13.58 J7.3
SERVO6
  Top 0.3: U2.11 10.12,8.14 7.3,10.95 7.3,12.24 J8.3
SERVO7
  Top 0.3: U2.12 7.49,7.49 J9.3
SERVO8
  Top 0.3: U2.13 9.38,6.84 J10.3
SERVO9
  Top 0.3: U2.15 18.16,3.68 15.8,1.32 7.68,1.32 7.68,1.4 J11.3
SERVO10
  Top 0.3: J12.3 69.46,22.54 53.98,22.54 53.79,22.73 UC1.19
SERVO11
  Top 0.3: UC1.18 53.5,22.23 53.82,21.91 69.85,21.91 73.4,25.46 J13.3
SERVO12
  Top 0.3: UC1.17 53.2,21.73 53.66,21.27 70.17,21.27 71.81,22.92 J14.3
SERVO13
  Top 0.3: J15.3 74.92,19.06 73.03,20.95 70.8,20.95 70.48,20.64 53.5,20.64 52.91,21.23 UC1.16
SERVO14  (via drill 0.3)
  Top 0.3: v27.33,12.19 21.19,12.19 19.74,10.74 U2.22
  Bottom 0.3: v27.33,12.19 68.77,12.19 71.12,9.84 72.71,9.84 73.5,10.64 73.5,13.49 74.93,14.92 J16.3
SERVO15  (via drill 0.3)
  Top 0.3: v26.35,11.43 21.34,11.43 20,10.09 U2.21
  Bottom 0.3: v26.35,11.43 68.58,11.43 71.12,8.89 73.34,8.89 74.92,10.47 J17.3
SERVO16  (via drill 0.3)
  Top 0.3: v27.34,10.67 21.67,10.67 20.44,9.44 U2.20
  Bottom 0.3: v27.34,10.67 68.26,10.67 71.85,7.08 J18.3
SERVO17  (via drill 0.3)
  Top 0.3: v26.35,9.91 21.84,9.91 20.73,8.79 U2.19
  Bottom 0.3: v26.35,9.91 67.94,9.91 73.31,4.54 J19.3
SERVO18  (via drill 0.3)
  Top 0.3: v27.36,9.14 22.1,9.14 21.09,8.14 U2.18
  Bottom 0.3: v27.36,9.14 67.63,9.14 74.77,2 J20.3
SERVO19
  Top 0.3: U2.17 21.46,7.49 22.35,8.38 24.7,8.38 J21.3
SERVO20
  Top 0.3: U2.16 23.22,6.84 J22.3
UART1_RX
  Top 0.3: UC1.31 37.63,27.73 38.35,28.45 49.46,28.45 R1.2
UART1_TX
  Top 0.3: UC1.30 38.13,27.47 38.35,27.69 47.31,27.69 48,27 49.57,27 R2.2
USBDM
  Top 0.3: C12.1 R14.2 21.5,17.68 21.84,17.34 25.21,17.34 25.91,18.03 25.91,25.89 28.46,28.45 36.58,28.45 37.13,27.89 UC1.32
USBDP
  Top 0.3: C13.1 R13.2 20.04,18.13 21.59,16.57 25.21,16.57 26.58,17.94 26.58,25.55 28.72,27.69 30,27.69 | UC1.33 36.63,27.37 36.32,27.69 30,27.69 | R20.1 29.94,27.63 30,27.69
V_BATT
  Top 0.3: R4.2 67,8 68.58,6.42
  Top 1: D1.A 35.53,4.66 35.56,4.63
  Top 1.5: 77.5,10 72.17,10 68.58,6.42 63.48,1.32 52,1.32 | 52,1.32 42,1.32 41.01,2.31 C5.+ 39.91,2.35 37.84,2.35 35.56,4.63 35.47,4.54 J21.2 J22.2 | Q1.2 52.25,1.56 52,1.32 | 77.5,10 77.46,9.96 J18.2 J19.2 J20.2 | J12.2 J13.2 J14.2 J15.2 77.46,15.04 77.5,15 77.46,14.96 J17.2 77.5,12.42 77.5,10 | J3.2 J4.2 J5.2 J6.2 J7.2 J8.2 J9.2 J10.2 J11.2
  Bottom 1: 4.54,2.04 4.5,2
  Bottom 1.5: 4.54,9.96 4.54,2.04 | J22.2 18.95,4.54 13.53,9.96 4.54,9.96 | 4.54,9.96 J6.2 | J5.2 J4.2 J3.2 | J17.2 J16.2 J15.2 | J18.2 J19.2 J20.2 | J14.2 J13.2 J12.2
V_USB
  Top 0.5: F1.2 15.39,16.84 D3.A
VBAT_SENS
  Top 0.3: UC1.13 44.23,19.73 45.95,18 48,18 49,17 49,13 52,10 65.35,10 R5.2 R4.1
VUSB-RAW
  Top 0.4: 15.81,21.34 F1.1 16.23,21.75 17.78,21.75 18.18,22.15 J2.VBUS2 18.18,23.74 19.37,24.92 21.91,24.92 23.09,23.75 J2.VBUS1

### Text on the board
tNames: 01 | 10 | 02 | PI ZERO | 11 | 03 | BOOT1 | 12 | BOOT0 | RXD | TXD | GND | 5V | 5V | GND | IO4 | IO3 | IO2 | 3V3 | PWM | VCC | GND | SDA | GND | VCC | PWM | 04 | RESET | SCL | 05 | GND | 06 | 3.3V | PWM | VCC | GND | GND | VCC | PWM | 20 | 19 | - | + | 07 | PWM | 16 | 08 | VCC | 17 | 09 | GND | 18
bNames: 01 | 10 | 02 | 11 | 03 | GND | RXD | IO4 | TXD | GND | IO3 | 5V | IO2 | 3V3 | 5V | 12 | 13 | 04 | 14 | 05 | 15 | 06 | 20 | 19 | 07 | Hexapod REV 1 / Maximilian Kern 03/2021 / github.com/CoretechR | 16 | 08 | 17 | 09 | - | + | 18